# Altium project Card Shuffling-Dealing Machine.PrjPcb
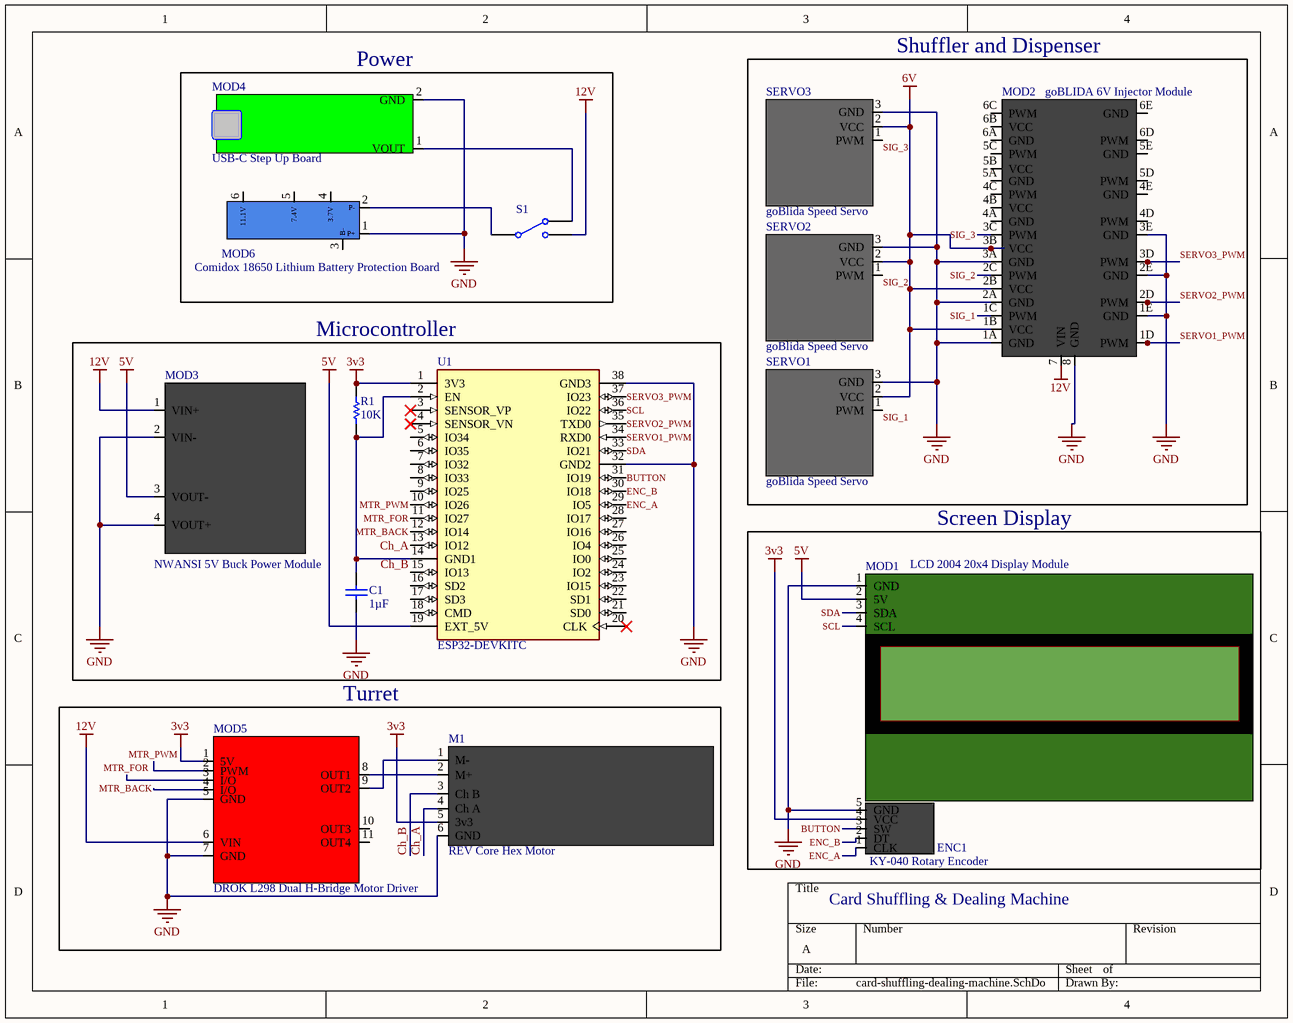
[diagram p0: card-shuffling-dealing-machine.SchDoc]
1 sheet, 15 parts. Net scope: global (net labels, ports and power ports of the same name join across sheets).

## Sheet card-shuffling-dealing-machine.SchDoc
size A; SheetNumber: 1; SheetTotal: 1

### Parts
C1  value 1µF  (hidden comment: Capacitor)
ENC1  KY-040 Rotary Encoder
M1  REV Core Hex Motor
MOD1  LCD 2004 20x4 Display Module
MOD2  goBLIDA 6V Injector Module
MOD3  NWANSI 5V Buck Power Module
MOD4  USB-C Step Up Board
MOD5  DROK L298 Dual H-Bridge Motor Driver
MOD6  Comidox 18650 Lithium Battery Protection Board
R1  value 10K  (hidden comment: Resistor)
S1  Single-Pole, Double-Throw Switch  (value not drawn)
SERVO1  goBlida Speed Servo
SERVO2  goBlida Speed Servo
SERVO3  goBlida Speed Servo
U1  ESP32-DEVKITC  [MODULE_ESP32-DEVKITC]

### Blocks framed on the sheet
Power: MOD4 MOD6 S1
Shuffler and Dispenser: MOD2 SERVO1-SERVO3
Microcontroller: C1 MOD3 R1 U1
Screen Display: ENC1 MOD1
Turret: M1 MOD5

### Nets
3v3: ENC1.4(VCC) M1.5(3v3) MOD5.1(5V) R1.2 U1.1(3V3)
5V: MOD1.2(5V) MOD3.3(VOUT-) U1.19(EXT_5V)
6V: MOD2.1B(VCC) MOD2.2B(VCC) MOD2.3B(VCC) SERVO1.2(VCC) SERVO2.2(VCC) SERVO3.2(VCC)
12V: MOD2.7(VIN) MOD3.1(VIN+) MOD5.6(VIN) S1.2
GND: C1.1 ENC1.5(GND) M1.6(GND) MOD1.1(GND) MOD2.1A(GND) MOD2.1E(GND) MOD2.2A(GND) MOD2.2E(GND) MOD2.3A(GND) MOD2.3E(GND) MOD2.8(GND) MOD3.2(VIN-) MOD3.4(VOUT+) MOD4.2(GND) MOD5.5(GND) MOD5.7(GND) MOD6.1(P+) SERVO1.3(GND) SERVO2.3(GND) SERVO3.3(GND) U1.32(GND2) U1.38(GND3)
BUTTON: ENC1.3(SW) U1.31(IO19)
Ch_A: M1.4(Ch_A) U1.13(IO12)
Ch_B: M1.3(Ch_B) U1.15(IO13)
ENC_A: ENC1.1(CLK) U1.29(IO5)
ENC_B: ENC1.2(DT) U1.30(IO18)
MTR_BACK: MOD5.4(I/O) U1.12(IO14)
MTR_FOR: MOD5.3(I/O) U1.11(IO27)
MTR_PWM: MOD5.2(PWM) U1.10(IO26)
SCL: MOD1.4(SCL) U1.36(IO22)
SDA: MOD1.3(SDA) U1.33(IO21)
SERVO1_PWM: MOD2.1D(PWM) U1.34(RXD0)
SERVO2_PWM: MOD2.2D(PWM) U1.35(TXD0)
SERVO3_PWM: MOD2.3D(PWM) U1.37(IO23)
SIG_1: MOD2.1C(PWM) SERVO1.1(PWM)
SIG_2: MOD2.2C(PWM) SERVO2.1(PWM)
SIG_3: MOD2.3C(PWM) SERVO3.1(PWM)
NetC1_2: C1.2 R1.1 U1.2(EN) U1.14(GND1)
NetM1_1: M1.1(M-) MOD5.9(OUT2)
NetM1_2: M1.2(M+) MOD5.8(OUT1)
NetMOD4_1: MOD4.1(VOUT) S1.3
NetMOD6_2: MOD6.2(P-) S1.1

Not connected (* = marked no-connect by the designer): MOD2 4A(GND) 4B(VCC) 4C(PWM) 4D(PWM) 4E(GND) 5A(GND) 5B(VCC) 5C(PWM) 5D(PWM) 5E(GND) 6A(GND) 6B(VCC) 6C(PWM) 6D(PWM) 6E(GND); MOD5 10(OUT3) 11(OUT4); MOD6 3(B-) 4(3.7V) 5(7.4V) 6(11.1V); U1 3(SENSOR_VP)* 4(SENSOR_VN)* 5(IO34) 6(IO35) 7(IO32) 8(IO33) 9(IO25) 16(SD2) 17(SD3) 18(CMD) 20(CLK)* 21(SD0) 22(SD1) 23(IO15) 24(IO2) 25(IO0) 26(IO4) 27(IO16) 28(IO17)

### Notes on the sheet
- (near ENC1) Card Shuffling & Dealing Machine

### Library data of the parts
C1 = Capacitor: SimulationGenericComponent: True
ENC1 = KY-040_Rotary_Encoder: 5V Rotary Encoder Module 360 Degree Switch Encoder
M1 = REV_Core_Hex_Motor: 12 V DC Gear Motor with Integrated Encoder; ComponentLink1Description: Datasheet; ComponentLink1URL: https://www.revrobotics.com/rev-41-1300/
MOD1 = LCD_2004_20x4_Display_Module: LCD 2004 I2C (TWI) 20x4 Display Module
MOD2 = goBLIDA_6V_Injector_Module: 8-15V Input to 6V 24A Injector Module
MOD3 = NWANSI_Buck_Power_Module: DC 12/24V to 5V 3A/15W Power Converter Buck Power Module
MOD4 = Type_C_Step_Up_Boost: Converts USB C 5V to 12.6V
MOD5 = L298_Dual_H_Bridge_Motor_Driver: 7A Dual DC Motor Controller Board (6.5V-27V Input, Optocoupler Isolated)
MOD6 = Comidox_18650_Lithium_Battery_Protection_Board: 3S 12V 10A 18650 Lithium Battery Protection Board
R1 = Resistor: TC1: 0; SimulationGenericComponent: True; TC2: 0
S1 = SPDT SW: nodeUP_closed: 1; Rclosed: 1m; Ropen: 1Meg; SimulationGenericComponent: True
SERVO1-SERVO3 = goBIDA_Speed_Servo: Dual-Mode Servo (PWM/Continuous)
U1 = CMP-718-000000-1: ESP32-WROOM-32UE series Transceiver; 802.11 b/g/n (Wi-Fi, WiFi, WLAN), Bluetooth Â® Smart Ready 4.x Dual Mode Evaluation Board; MF: Espressif Systems; SnapEDA_Link: https://www.snapeda.com/parts/ESP32-DEVKITC/Espressif+Systems/view-part/?ref=snap; Design Item ID: ESP32-DEVKITC; Source: ESP32-DEVKITC.SchLib; Package: None; Value: *; Pin Count: 38; MP: ESP32-DEVKITC; Check_prices: https://www.snapeda.com/parts/ESP32-DEVKITC/Espressif+Systems/view-part/?ref=eda; Component Type: Standard